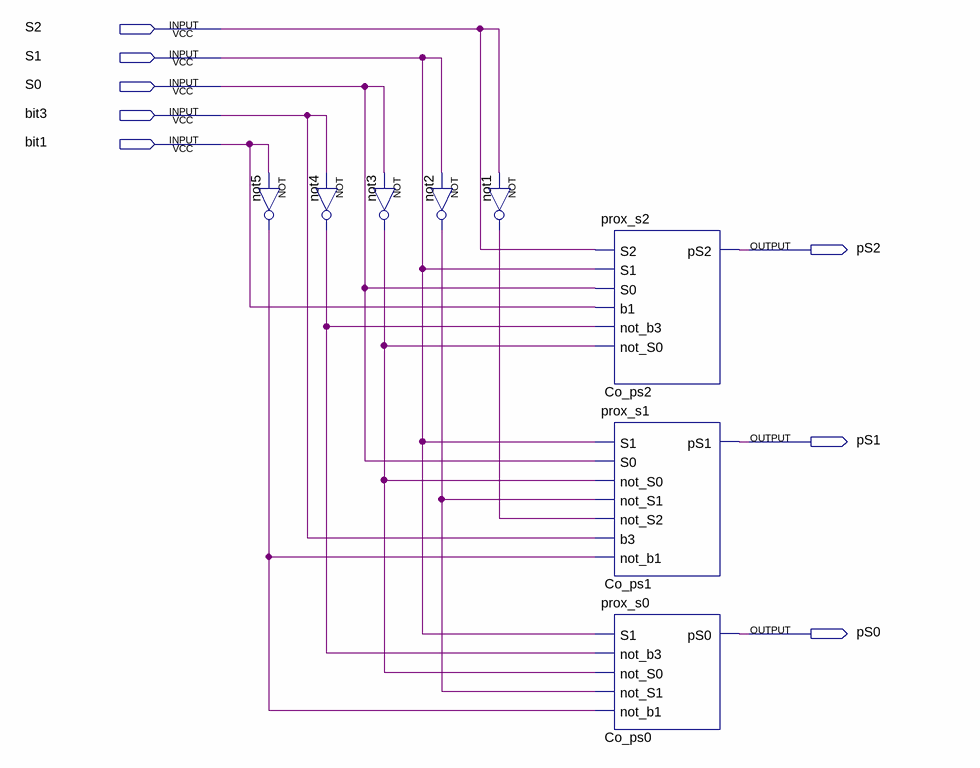
[diagram p0: schematic sheet]
// Quartus schematic controle_estados.bdf as structural Verilog: 8 symbols, 8 pins
module controle_estados (
  input  S2,
  input  S1,
  input  S0,
  input  bit3,
  input  bit1,
  output pS2,
  output pS1,
  output pS0
);

  wire not1_out, not2_out, not3_out, not4_out, not5_out;

  not not4 (not4_out, bit3);
  not not5 (not5_out, bit1);
  not not3 (not3_out, S0);
  not not2 (not2_out, S1);
  not not1 (not1_out, S2);
  prox_s2 Co_ps2 (.S2(S2), .S1(S1), .S0(S0), .b1(bit1), .not_b3(not4_out), .not_S0(not3_out), .pS2(pS2));
  prox_s1 Co_ps1 (
    .S1(S1), .S0(S0), .not_S0(not3_out), .not_S1(not2_out), .not_S2(not1_out), .b3(bit3), .not_b1(not5_out),
    .pS1(pS1));
  prox_s0 Co_ps0 (.S1(S1), .not_b3(not4_out), .not_S0(not3_out), .not_S1(not2_out), .not_b1(not5_out), .pS0(pS0));
endmodule
